# EAGLE design AVR28 (EAGLE 6.5.0)
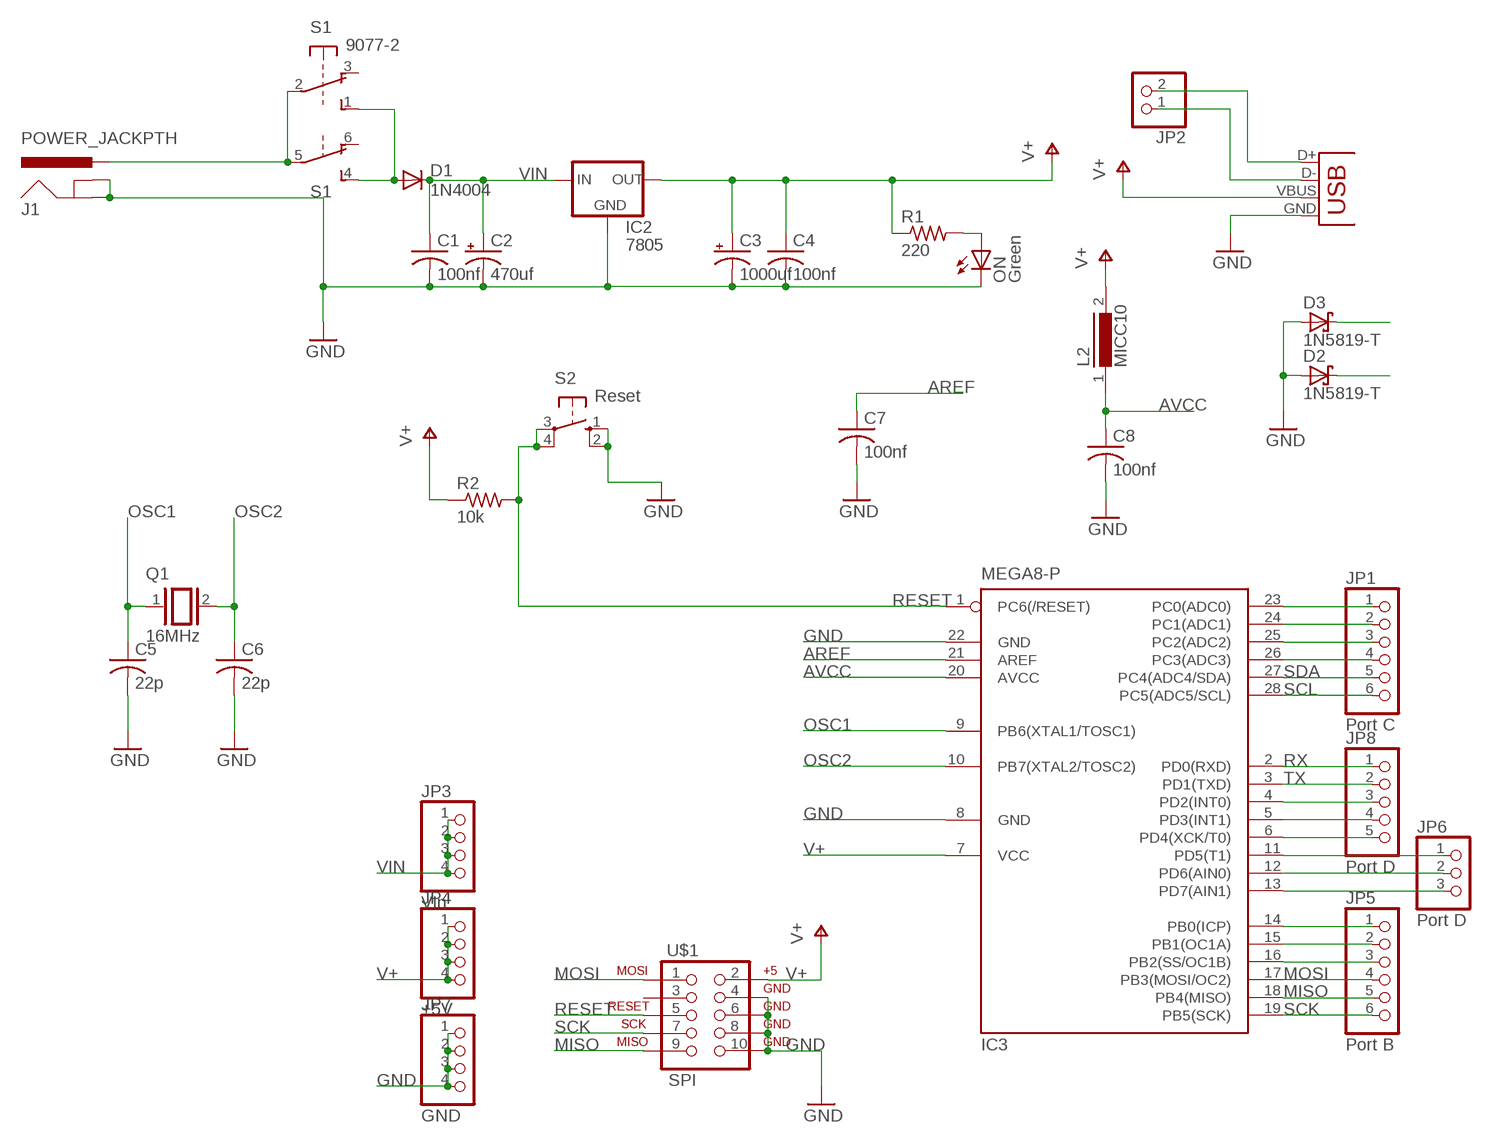
[diagram p0: schematic, sheet 1]

## Parts
C1  100nf  C-US050-025X075  [C050-025X075]
C2  470uf  CPOL-USE3.5-8  [E3,5-8]
C3  1000uf  CPOL-USE3.5-8  [E3,5-8]
C4  100nf  C-US050-025X075  [C050-025X075]
C5  22p  C-US050-025X075  [C050-025X075]
C6  22p  C-US050-025X075  [C050-025X075]
C7  100nf  C-US050-025X075  [C050-025X075]
C8  100nf  C-US050-025X075  [C050-025X075]
D1  1N4004  [DO41-10]
D2  1N5819-T  [DO41-7.6]
D3  1N5819-T  [DO41-7.6]
IC2  7805  V_REG_78XXSIDE  [78XXL]
IC3  MEGA8-P  [DIL28-3]
J1  POWER_JACKPTH  [POWER_JACK_PTH]
JP1  Port C  PINHD-1X6  [1X06]
JP2  PINHD-1X2  [1X02]
JP3  VIn  PINHD-1X4  [1X04]
JP4  +5V  PINHD-1X4  [1X04]
JP5  Port B  PINHD-1X6  [1X06]
JP6  Port D  PINHD-1X3  [1X03]
JP7  GND  PINHD-1X4  [1X04]
JP8  Port D  PINHD-1X5  [1X05]
L2  MICC10  [MICC10]
ON  Green  LED3MM  [LED3MM]
Q1  16MHz  XTAL/S  [QS]
R1  220  R-US_0207/10  [0207/10]
R2  10k  R-US_0207/10  [0207/10]
S1  9077-2  [9077-2]
S2  Reset  10-XX  [B3F-10XX]
U$1  SPI  AVR_SPI_PROG2LOCK  [2X5-SHROUDED_LOCK]
X1  USBPTH  [USB-B-PTH]

## Nets
AREF: C7.1 IC3.21(AREF)
AVCC: C8.1 IC3.20(AVCC) L2.1
D+: D2.C JP2.2 X1.D+
D-: D3.C JP2.1 X1.D-
GND: C1.2 C2.- C3.- C4.2 C5.2 C6.2 C7.2 C8.2 D2.A D3.A IC2.GND IC3.8(GND) IC3.22(GND) J1.GND J1.GNDBREAK JP7.1 JP7.2 JP7.3 JP7.4 ON.K(C) S2.1(S) S2.2(S1) U$1.4 U$1.6 U$1.8 U$1.10 X1.GND
MISO: IC3.18(PB4(MISO)) JP5.5 U$1.9
MOSI: IC3.17(PB3(MOSI/OC2)) JP5.4 U$1.1
N$1: J1.PWR S1.2(1:P) S1.5(2:P)
N$2: D1.A S1.1(1:S) S1.4(2:S)
N$3: IC3.23(PC0(ADC0)) JP1.1
N$4: ON.A R1.2
N$5: IC3.24(PC1(ADC1)) JP1.2
N$6: IC3.25(PC2(ADC2)) JP1.3
N$7: IC3.26(PC3(ADC3)) JP1.4
N$12: IC3.4(PD2(INT0)) JP8.3
N$13: IC3.5(PD3(INT1)) JP8.4
N$14: IC3.6(PD4(XCK/T0)) JP8.5
N$15: IC3.11(PD5(T1)) JP6.1
N$16: IC3.12(PD6(AIN0)) JP6.2
N$17: IC3.13(PD7(AIN1)) JP6.3
N$18: IC3.14(PB0(ICP)) JP5.1
N$19: IC3.15(PB1(OC1A)) JP5.2
N$20: IC3.16(PB2(SS/OC1B)) JP5.3
OSC1: C5.1 IC3.9(PB6(XTAL1/TOSC1)) Q1.1
OSC2: C6.1 IC3.10(PB7(XTAL2/TOSC2)) Q1.2
RESET: IC3.1(PC6(/RESET)) R2.2 S2.3(P) S2.4(P1) U$1.5
RX: IC3.2(PD0(RXD)) JP8.1
SCK: IC3.19(PB5(SCK)) JP5.6 U$1.7
SCL: IC3.28(PC5(ADC5/SCL)) JP1.6
SDA: IC3.27(PC4(ADC4/SDA)) JP1.5
TX: IC3.3(PD1(TXD)) JP8.2
V+: C3.+ C4.1 IC2.OUT IC3.7(VCC) JP4.1 JP4.2 JP4.3 JP4.4 L2.2 R1.1 R2.1 U$1.2 X1.VBUS
VIN: C1.1 C2.+ D1.C IC2.IN JP3.1 JP3.2 JP3.3 JP3.4
Unconnected: S1.3(1:O) S1.6(2:O) U$1.3

## Library data of the parts
C1 C4-C8 = rcl:C-US: CAPACITOR, American symbol
C2 C3 = rcl:CPOL-US: POLARIZED CAPACITOR, American symbol
D1 = diode:1N4004: DIODE general purpose rectifier, 1 A
D2 D3 = diode:1N581*: 1.0A SCHOTTKY BARRIER RECTIFIER Source: http://www.diodes.com/datasheets/ds23001.pdf
IC2 = SparkFun:V_REG_78XX: Voltage Regulator Standard 7805 5V regulator. IGO (Input Ground Output). Spark Fun Electronics SKU : COM-00107
IC3 = atmel:MEGA8-P: MICROCONTROLLER 8 Kbytes FLASH, 1 kbytes SRAM, 512 bytes EEPROM, USART, 4-channel 10 bit ADC, 2-channel 8 bit ADC Pin compatible with Atmega48, ATMega88, ATMega168 Source: avr.lbr; OC_FARNELL: unknown; OC_NEWARK: unknown
J1 = SparkFun-Connectors:POWER_JACK: Power Jack This is the standard 5.5mm barrel jack for power. The PTH is the most common, proven, reliable, footprint. All others are experimental. The Slot footprint only works if the mill layer is transmitted to the PCB fab house so be warned. Spark Fun Electronics SKU : PRT-00119. Mating wall wart : TOL-00298 (and others)
JP1 JP5 = pinhead:PINHD-1X6: PIN HEADER
JP2 = pinhead:PINHD-1X2: PIN HEADER
JP3 JP4 JP7 = pinhead:PINHD-1X4: PIN HEADER
JP6 = pinhead:PINHD-1X3: PIN HEADER
JP8 = pinhead:PINHD-1X5: PIN HEADER
L2 = inductors:MICC10: INDUCTOR
ON = SparkFun-LED:LED: LEDs Standard schematic elements and footprints for 5mm, 3mm, 1206, and 0603 sized LEDs. 5mm - Spark Fun Electronics SKU : COM-00529 (and others)
Q1 = special:XTAL/S: CRYSTAL
R1 R2 = rcl:R-US_: RESISTOR, American symbol
S1 = switch-misc:9077-2: MARQUARDT SWITCH 9077.0200 Distributor: Buerklin <https://www.buerklin.com/default.asp?event=ShowArtikel%2812G2822%29&l=d&jump=ArtNr_12G2822>
S2 = switch-omron:10-XX: OMRON SWITCH; MPN: B3F-1000; OC_FARNELL: 176432; OC_NEWARK: 36M3542
U$1 = SparkFun:AVR_SPI_PROG2: AVR ICSP Header This is the standard AVR In Circuit Serial Programming header. Minimal, but includes pin one indicator. Works with standard Olimex programmers. Also look for the 6-pin reduced version. Spark Fun Electronics SKU: PRT-00778
X1 = SparkFun-Connectors:USB: USB Connectors USB-B-PTH is fully proven SKU : PRT-00139 USB-miniB is fully proven SKU : PRT-00587 USB-A-PCB is untested. USB-A-H is throughly reviewed, but untested. Spark Fun Electronics SKU : PRT-00437 USB-B-SMT is throughly reviewed, but untested. Needs silkscreen touching up. USB-A-S has not been used/tested USB-MB-H has not been used/tested

## Board
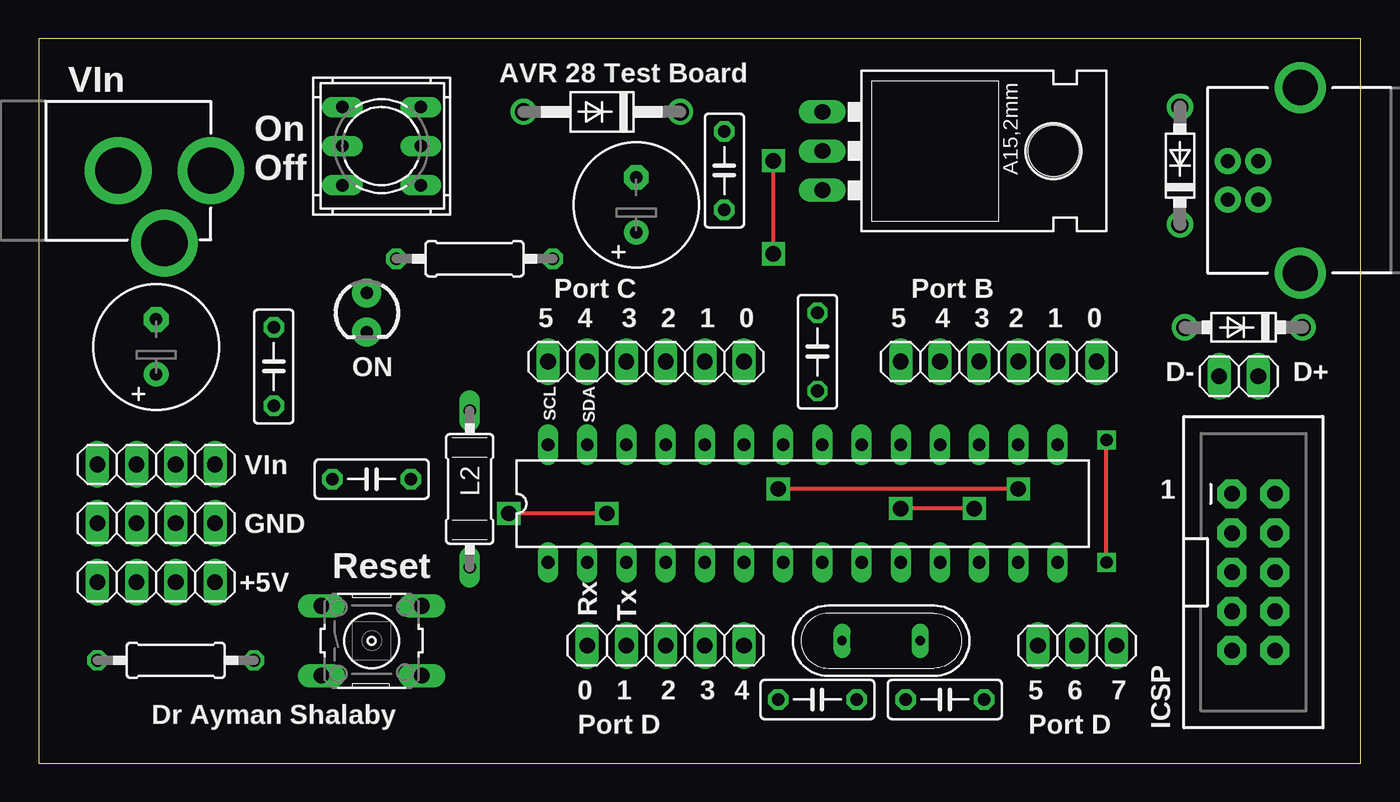
[diagram p1: board, top side]
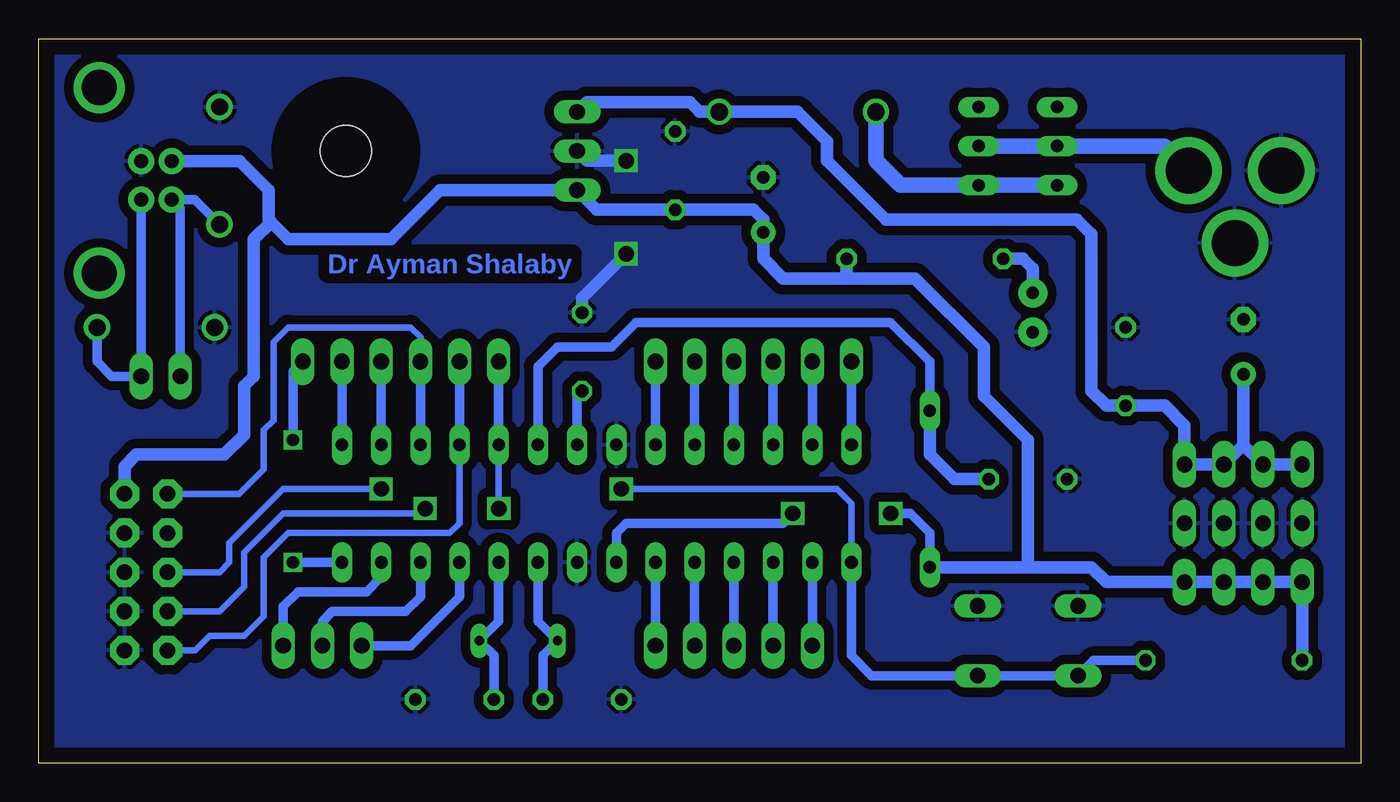
[diagram p2: board, bottom side, seen from below]

Size 85.7 x 46.98 mm. Coordinates in mm from the lower left corner, seen from the top.
Outline: 0,0 85.7,0 85.7,46.98 0,46.98 0,0
Copper layers (1*16): Top 0.035mm / dielectric 1.5mm / Bottom 0.035mm
Design rules "default": minimum track width 10mil, minimum drill 24mil, track to track 8mil, track to pad 8mil, pad to pad 8mil, via to via 8mil, smd to smd 8mil, copper to edge 40mil, drill to drill 8mil, minimum pad ring 10mil, minimum via ring 8mil, stop-mask expansion 4mil, vias tented up to drill 0mil, thermal gap 10mil

### Footprints (pad centres in the part's own frame; a part is rotated, then mirrored left to right if it is on the bottom)
C050-025X075 = drill 0.813 octagon: 1 -2.54,0; 2 2.54,0
E3,5-8 = drill 0.813 pad 1.6: + -1.778,0 | drill 0.813 pad 1.6 octagon: - 1.778,0
DO41-10 = drill 1.118: A 5.08,0; C -5.08,0
DO41-7.6 = drill 1.1 pad 1.7: A 3.81,0; C -3.81,0
78XXL = drill 1.016 long: GND 0,-3.81; IN -2.54,-3.81; OUT 2.54,-3.81 | hole 3.302: 0,11.176
DIL28-3 = drill 0.813 long: 1 -16.51,-3.81; 2 -13.97,-3.81; 3 -11.43,-3.81; 4 -8.89,-3.81; 5 -6.35,-3.81; 6 -3.81,-3.81; 7 -1.27,-3.81; 8 1.27,-3.81; 9 3.81,-3.81; 10 6.35,-3.81; 11 8.89,-3.81; 12 11.43,-3.81; 13 13.97,-3.81; 14 16.51,-3.81; 15 16.51,3.81; 16 13.97,3.81; 17 11.43,3.81; 18 8.89,3.81; 19 6.35,3.81; 20 3.81,3.81; 21 1.27,3.81; 22 -1.27,3.81; 23 -3.81,3.81; 24 -6.35,3.81; 25 -8.89,3.81; 26 -11.43,3.81; 27 -13.97,3.81; 28 -16.51,3.81
POWER_JACK_PTH = drill 2.997 pad 4.318: GND 0,7.7; GNDBREAK 4.7,10.7; PWR 0,13.7
1X06 = drill 1.016 long: 1 -6.35,0; 2 -3.81,0; 3 -1.27,0; 4 1.27,0; 5 3.81,0; 6 6.35,0
1X02 = drill 1.016 long: 1 -1.27,0; 2 1.27,0
1X04 = drill 1.016 long: 1 -3.81,0; 2 -1.27,0; 3 1.27,0; 4 3.81,0
1X03 = drill 1.016 long: 1 -2.54,0; 2 0,0; 3 2.54,0
1X05 = drill 1.016 long: 1 -5.08,0; 2 -2.54,0; 3 0,0; 4 2.54,0; 5 5.08,0
MICC10 = drill 0.813 long: 1 -5.08,0; 2 5.08,0
LED3MM = drill 0.813 pad 1.88: A -1.27,0; K 1.27,0
QS = drill 0.61 long: 1 -2.54,0; 2 2.54,0
0207/10 = drill 0.813 octagon: 1 -5.08,0; 2 5.08,0
9077-2 = drill 0.813 long: 1 -2.54,2.54; 2 0,2.54; 3 2.54,2.54; 4 -2.54,-2.54; 5 0,-2.54; 6 2.54,-2.54
B3F-10XX = drill 1.016 long: 1 -3.251,2.261; 2 3.251,2.261; 3 -3.251,-2.261; 4 3.251,-2.261
2X5-SHROUDED_LOCK = drill 1.016 pad 1.88 octagon: 1 -1.397,5.08; 2 1.397,5.08; 3 -1.397,2.54; 4 1.397,2.54; 5 -1.397,0; 6 1.397,0; 7 -1.397,-2.54; 8 1.397,-2.54; 9 -1.397,-5.08; 10 1.397,-5.08
USB-B-PTH = drill 0.914 pad 1.676: D+ 0,1.25; D- 1.981,1.25; GND 0,-1.25; VBUS 1.981,-1.25 | drill 2.286: S1 -2.718,-6.02; S2 -2.718,6.02

### Placement (x,y rotation side)
C1  15.24,25.72 90 top
C2  7.62,26.99 90 top
C3  38.73,36.19 90 top
C4  44.45,38.42 90 top
C5  50.48,4.13 180 top
C6  58.74,4.13 0 top
C7  50.48,26.67 90 top
C8  21.59,18.41 180 top
D1  36.51,42.23 180 top
D2  78.11,28.26 180 top
D3  73.98,38.73 90 top
IC2  54.61,39.69 270 top
IC3  49.53,16.83 0 top
J1  -2.54,38.42 270 top
JP1  39.37,26.03 180 top
JP2  77.79,25.08 0 top
JP3  7.62,19.37 0 top
JP4  7.62,11.75 0 top
JP5  62.23,26.03 180 top
JP6  67.31,7.62 0 top
JP7  7.62,15.56 0 top
JP8  40.64,7.62 0 top
L2  27.94,17.78 270 top
ON  21.27,29.21 270 top
Q1  54.61,7.94 0 top
R1  28.26,32.7 180 top
R2  8.89,6.67 0 top
S1  22.23,40 90 top
S2  21.59,7.94 0 top
U$1  78.74,12.38 0 top
X1  79.06,37.78 180 top

### Tracks (layer width: path | path; a pad name or v marks a point on that pad's centre or on a via)
AREF
  Bottom 0.61: IC3.21 50.8,23.81 C7.1
AVCC
  Bottom 0.61: IC3.20 53.34,25.72 52.07,26.99 48.58,26.99 46.99,28.58 30.48,28.58 27.94,26.03 L2.1
  Bottom 0.813: C8.1 26.35,18.41 27.94,20 L2.1
D+
  Bottom 0.61: X1.D+ JP2.2 80.96,25.08 81.92,26.03 D2.C
D-
  Bottom 0.61: D3.C 75.58,36.53 X1.D- 76.52,35.97 JP2.1
GND  (via drill 1)
  Top 0.254: v47.62,33.02 v47.62,39.05
  Bottom 0.813: C7.2 50.48,30.16 v47.62,33.02 | v47.62,39.05 50.16,39.05 IC2.GND
  pour Bottom (isolate 0.61): 85.72,47.31 0,47.31 0,0 85.72,0
MISO
  Bottom 0.406: 58.74,20.32 IC3.18 58.42,15.56 59.05,14.92 69.53,14.92 71.12,13.34 71.12,9.53 72.39,8.25 74.61,8.25 75.56,7.3 U$1.9
  Bottom 0.61: IC3.18 JP5.5
MOSI
  Bottom 0.406: JP5.4 60.96,27.62 61.59,28.26 69.53,28.26 70.48,27.3 70.48,22.22 71.12,21.59 71.12,19.05 72.71,17.46 U$1.1
  Bottom 0.61: IC3.17 JP5.4
N$1
  Bottom 1.016: J1.PWR 12.75,40 S1.2 S1.5
N$2
  Bottom 1.016: S1.1 S1.4 29.84,37.47 31.43,39.05 D1.A
N$3
  Bottom 0.61: IC3.23 JP1.1
N$4
  Bottom 0.813: R1.2 21.91,32.7 21.27,32.07 ON.A
N$5
  Bottom 0.61: IC3.24 JP1.2
N$6
  Bottom 0.61: IC3.25 JP1.3
N$7
  Bottom 0.61: IC3.26 JP1.4
N$12
  Bottom 0.61: JP8.3 IC3.4
N$13
  Bottom 0.61: JP8.4 IC3.5
N$14
  Bottom 0.61: JP8.5 IC3.6
N$15
  Bottom 0.61: JP6.1 61.59,7.62 58.42,10.8 IC3.11
N$16
  Bottom 0.61: JP6.2 67.31,9.21 66.67,9.84 61.91,9.84 60.96,10.8 IC3.12
N$17
  Bottom 0.61: JP6.3 69.85,10.16 68.9,11.11 64.45,11.11 63.5,12.06 IC3.13
N$18  (via drill 0.8)
  Top 0.254: v69.22,13.02 v69.22,20.96
  Bottom 0.61: IC3.14 v69.22,13.02 | v69.22,20.96 69.22,25.4 JP5.1
N$19
  Bottom 0.61: IC3.15 JP5.2
N$20
  Bottom 0.61: IC3.16 JP5.3
OSC1
  Bottom 0.61: IC3.9 53.34,9.21 Q1.1 53.02,6.99 C5.1
OSC2
  Bottom 0.61: IC3.10 55.88,9.21 Q1.2 56.2,6.99 C6.1
RESET  (via drill 1)
  Top 0.254: v63.5,17.78 v47.94,17.78
  Bottom 0.406: IC3.1 33.02,16.83 33.97,17.78 v47.94,17.78 | v63.5,17.78 69.85,17.78 73.34,14.29 73.34,13.02 73.98,12.38 U$1.5
  Bottom 0.61: R2.2 17.35,6.67 S2.3 S2.4 31.71,5.68 33.02,6.99 IC3.1
RX
  Bottom 0.61: JP8.1 IC3.2
SCK  (via drill 1)
  Top 0.254: v60.64,16.51 v55.88,16.51
  Bottom 0.406: v55.88,16.51 IC3.19 | v60.64,16.51 60.96,16.19 69.85,16.19 72.39,13.65 72.39,11.43 73.98,9.84 U$1.7
  Bottom 0.61: IC3.19 JP5.6
SCL
  Bottom 0.61: IC3.28 JP1.6
SDA
  Bottom 0.61: IC3.27 JP1.5
TX
  Bottom 0.61: JP8.2 IC3.3
V+  (via drill 1)
  Top 0.254: v36.83,16.19 v30.48,16.19
  Bottom 0.61: v30.48,16.19 29.21,16.19 27.94,14.92 L2.2 | IC3.7 48.26,14.92 47.62,15.56 37.47,15.56 v36.83,16.19
  Bottom 0.813: R2.1 JP4.1 JP4.2 JP4.3 JP4.4 16.51,11.75 17.46,12.7 21.59,12.7 | L2.2 21.59,12.7 | 70.64,35.08 69.53,33.97 62.87,33.97 59.69,37.15 IC2.OUT 49.53,35.88 C4.1 39.37,35.88 38.73,35.24 C3.+ 38.73,32.7 37.47,31.43 33.02,31.43 | 70.64,35.08 70.8,35.24 70.8,37.15 72.69,39.03 X1.VBUS | U$1.2 80.14,19.24 79.38,20 73.66,20 72.39,21.27 72.39,24.45 71.75,25.08 71.75,33.97 70.64,35.08 | 33.02,31.43 28.89,31.43 24.45,26.99 24.45,23.81 21.59,20.96 21.59,12.7 | R1.1 33.34,31.75 33.02,31.43
VIN
  Bottom 0.813: C2.+ 7.62,20.64 | 7.62,20.64 JP3.3 JP3.4 11.43,21.91 12.7,23.18 C1.1 16.51,23.18 17.46,24.13 17.46,34.29 18.41,35.24 30.8,35.24 34.61,39.05 34.61,40.32 36.51,42.23 D1.C 42.86,42.23 43.5,42.86 50.16,42.86 IC2.IN | 7.62,20.64 JP3.2 JP3.1

### Text on the board
Bottom: Dr Ayman Shalaby
tPlace: AVR 28 Test Board | VIn | On | Off | 5 | 4 | 3 | 2 | 1 | 0 | 5 | 4 | 3 | 2 | 1 | 0 | ON | SCL | SDA | 1 | Reset | Rx | Tx | 0 | 1 | 2 | 3 | 4 | 5 | 6 | 7 | Dr Ayman Shalaby | ICSP
tNames: D- | D+